# Altium project DIgiBRD.PrjPcb
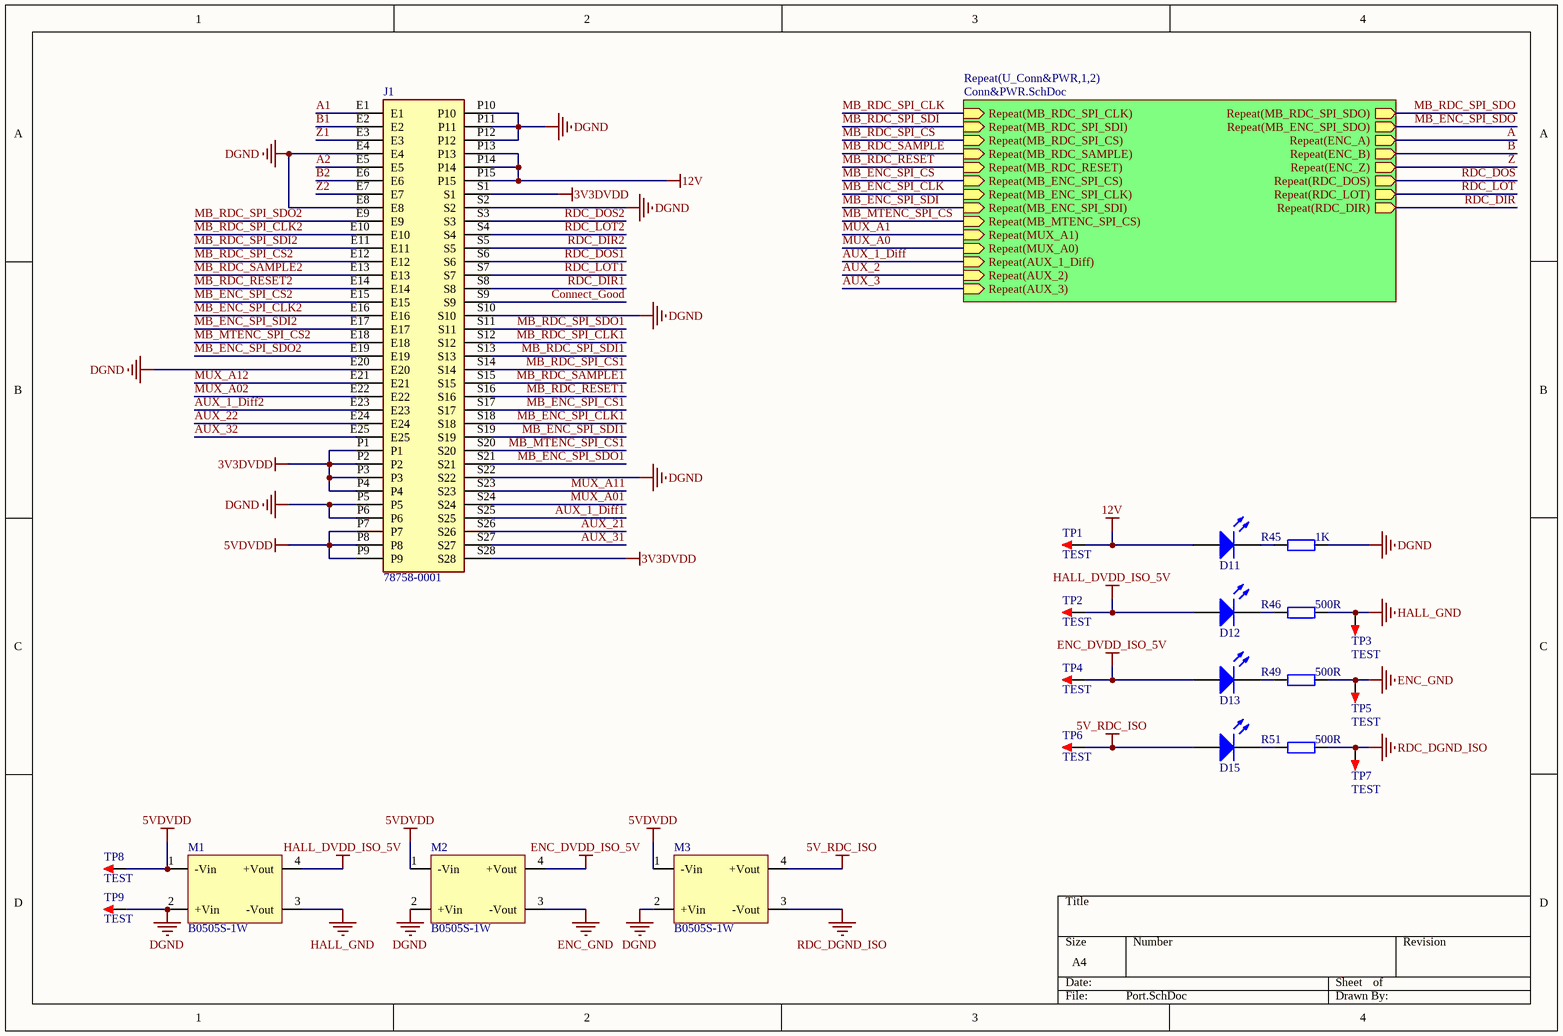
[diagram p0: Port.SchDoc]
4 sheets, 275 parts. Net scope: hierarchical (ports join the sheet entries above them; power ports are global).
Board file: DIGIBRD.PcbDoc
Sheets:
  Port.SchDoc
    U_Conn&PWR1 = Conn&PWR.SchDoc
      U_DiffEncoder = DiffEncoder.SchDoc
      U_Resolver = Resolver.SchDoc
    U_Conn&PWR2 = Conn&PWR.SchDoc
      U_DiffEncoder = DiffEncoder.SchDoc
      U_Resolver = Resolver.SchDoc

## Sheet Port.SchDoc
size A4; SheetNumber: 1; SheetTotal: 4

### Parts
D11  LED  [LED 0603W]  (value not drawn)
D12  LED  [LED 0603W]  (value not drawn)
D13  LED  [LED 0603W]  (value not drawn)
D15  LED  [LED 0603W]  (value not drawn)
J1  78758-0001  [78758-0001]
M1  B0505S-1W  [B0505S-1W]
M2  B0505S-1W  [B0505S-1W]
M3  B0505S-1W  [B0505S-1W]
R45  1K  [R 0603_L]
R46  500R  [R 0603_L]
R49  500R  [R 0603_L]
R51  500R  [R 0603_L]
TP1  TEST  [TEST 1.6]
TP2  TEST  [TEST 1.6]
TP3  TEST  [TEST 1.6]
TP4  TEST  [TEST 1.6]
TP5  TEST  [TEST 1.6]
TP6  TEST  [TEST 1.6]
TP7  TEST  [TEST 1.6]
TP8  TEST  [TEST 1.6]
TP9  TEST  [TEST 1.6]

### Sub-sheets
Repeat(U_Conn&PWR,1,2) = Conn&PWR.SchDoc: Repeat(MB_RDC_SPI_CLK) (in), Repeat(MB_RDC_SPI_SDI) (in), Repeat(MB_RDC_SPI_CS) (in), Repeat(MB_RDC_SAMPLE) (in), Repeat(MB_RDC_SPI_SDO) (out), Repeat(MB_RDC_RESET) (in), Repeat(MB_ENC_SPI_SDO) (out), Repeat(MB_ENC_SPI_CS) (in), Repeat(MB_ENC_SPI_CLK) (in), Repeat(MB_ENC_SPI_SDI) (in), Repeat(MB_MTENC_SPI_CS) (in), Repeat(ENC_A) (out), Repeat(ENC_B) (out), Repeat(ENC_Z) (out), Repeat(MUX_A1) (in), Repeat(MUX_A0) (in), Repeat(RDC_DOS) (out), Repeat(RDC_LOT) (out), Repeat(RDC_DIR) (out), Repeat(AUX_1_Diff) (in), Repeat(AUX_2) (in), Repeat(AUX_3) (in)

### Nets
3V3DVDD: J1.P1 J1.P2 J1.P3 J1.P4 J1.S1 J1.S28
5V_RDC_ISO: D15.1(A) M3.4(+Vout) TP6.1
5VDVDD: J1.P7 J1.P8 J1.P9 M1.1(-Vin) M2.1(-Vin) M3.1(-Vin) TP8.1
12V: D11.1(A) J1.P13 J1.P14 J1.P15 TP1.1
DGND: J1.E4 J1.E8 J1.E20 J1.P5 J1.P6 J1.P10 J1.P11 J1.P12 J1.S2 J1.S10 J1.S22 M1.2(+Vin) M2.2(+Vin) M3.2(+Vin) R45.1 TP9.1
ENC_DVDD_ISO_5V: D13.1(A) M2.4(+Vout) TP4.1
ENC_GND: M2.3(-Vout) R49.1 TP5.1
HALL_DVDD_ISO_5V: D12.1(A) M1.4(+Vout) TP2.1
HALL_GND: M1.3(-Vout) R46.1 TP3.1
RDC_DGND_ISO: M3.3(-Vout) R51.1 TP7.1
A: sheet Repeat(U_Conn&PWR,1,2)/Repeat(ENC_A)
A1: J1.E1
A2: J1.E5
AUX_1_Diff: sheet Repeat(U_Conn&PWR,1,2)/Repeat(AUX_1_Diff)
AUX_1_Diff1: J1.S25
AUX_1_Diff2: J1.E23
AUX_2: sheet Repeat(U_Conn&PWR,1,2)/Repeat(AUX_2)
AUX_3: sheet Repeat(U_Conn&PWR,1,2)/Repeat(AUX_3)
AUX_21: J1.S26
AUX_22: J1.E24
AUX_31: J1.S27
AUX_32: J1.E25
B: sheet Repeat(U_Conn&PWR,1,2)/Repeat(ENC_B)
B1: J1.E2
B2: J1.E6
Connect_Good: J1.S9
MB_ENC_SPI_CLK: sheet Repeat(U_Conn&PWR,1,2)/Repeat(MB_ENC_SPI_CLK)
MB_ENC_SPI_CLK1: J1.S18
MB_ENC_SPI_CLK2: J1.E16
MB_ENC_SPI_CS: sheet Repeat(U_Conn&PWR,1,2)/Repeat(MB_ENC_SPI_CS)
MB_ENC_SPI_CS1: J1.S17
MB_ENC_SPI_CS2: J1.E15
MB_ENC_SPI_SDI: sheet Repeat(U_Conn&PWR,1,2)/Repeat(MB_ENC_SPI_SDI)
MB_ENC_SPI_SDI1: J1.S19
MB_ENC_SPI_SDI2: J1.E17
MB_ENC_SPI_SDO: sheet Repeat(U_Conn&PWR,1,2)/Repeat(MB_ENC_SPI_SDO)
MB_ENC_SPI_SDO1: J1.S21
MB_ENC_SPI_SDO2: J1.E19
MB_MTENC_SPI_CS: sheet Repeat(U_Conn&PWR,1,2)/Repeat(MB_MTENC_SPI_CS)
MB_MTENC_SPI_CS1: J1.S20
MB_MTENC_SPI_CS2: J1.E18
MB_RDC_RESET: sheet Repeat(U_Conn&PWR,1,2)/Repeat(MB_RDC_RESET)
MB_RDC_RESET1: J1.S16
MB_RDC_RESET2: J1.E14
MB_RDC_SAMPLE: sheet Repeat(U_Conn&PWR,1,2)/Repeat(MB_RDC_SAMPLE)
MB_RDC_SAMPLE1: J1.S15
MB_RDC_SAMPLE2: J1.E13
MB_RDC_SPI_CLK: sheet Repeat(U_Conn&PWR,1,2)/Repeat(MB_RDC_SPI_CLK)
MB_RDC_SPI_CLK1: J1.S12
MB_RDC_SPI_CLK2: J1.E10
MB_RDC_SPI_CS: sheet Repeat(U_Conn&PWR,1,2)/Repeat(MB_RDC_SPI_CS)
MB_RDC_SPI_CS1: J1.S14
MB_RDC_SPI_CS2: J1.E12
MB_RDC_SPI_SDI: sheet Repeat(U_Conn&PWR,1,2)/Repeat(MB_RDC_SPI_SDI)
MB_RDC_SPI_SDI1: J1.S13
MB_RDC_SPI_SDI2: J1.E11
MB_RDC_SPI_SDO: sheet Repeat(U_Conn&PWR,1,2)/Repeat(MB_RDC_SPI_SDO)
MB_RDC_SPI_SDO1: J1.S11
MB_RDC_SPI_SDO2: J1.E9
MUX_A0: sheet Repeat(U_Conn&PWR,1,2)/Repeat(MUX_A0)
MUX_A01: J1.S24  [project net MUX_A0]
MUX_A1: sheet Repeat(U_Conn&PWR,1,2)/Repeat(MUX_A1)
MUX_A02: J1.E22  [project net MUX_A0]
MUX_A11: J1.S23  [project net MUX_A1]
MUX_A12: J1.E21  [project net MUX_A1]
RDC_DIR: sheet Repeat(U_Conn&PWR,1,2)/Repeat(RDC_DIR)
RDC_DIR1: J1.S8
RDC_DIR2: J1.S5
RDC_DOS: sheet Repeat(U_Conn&PWR,1,2)/Repeat(RDC_DOS)
RDC_DOS1: J1.S6
RDC_DOS2: J1.S3
RDC_LOT: sheet Repeat(U_Conn&PWR,1,2)/Repeat(RDC_LOT)
RDC_LOT1: J1.S7
RDC_LOT2: J1.S4
Z: sheet Repeat(U_Conn&PWR,1,2)/Repeat(ENC_Z)
Z1: J1.E3  [project net ENC_Z]
Z2: J1.E7  [project net ENC_Z]
NetD11_2: D11.2(K) R45.2
NetD12_2: D12.2(K) R46.2
NetD13_2: D13.2(K) R49.2
NetD15_2: D15.2(K) R51.2

### Library data of the parts
D11-D13 D15 = LED: 发光二极管; 技术支持，联系售后: https://shop463601444.taobao.com
J1 = 78758-0001: Connector; Manufacturer_Name: Molex; Manufacturer_Part_Number: 78758-0001; Mouser Part Number: 538-78758-0001; Mouser Price/Stock: https://www.mouser.co.uk/ProductDetail/Molex/78758-0001?qs=wOSGPAwRNAFEK7d2ROR5rw%3D%3D
M1-M3 = B0505S-1W: DC-DC模块; 版权归属: 封装库来自淘宝 ID：黄晶宝石; BOM名称: DC-DC模块; 学习资源: https://shop463601444.taobao.com
R45 R46 R49 R51 = R: 贴片电阻; 版权归属: 来自淘宝 ID：黄晶宝石; 封装库来自淘宝卖家 ID：黄晶宝石: 其他店铺购入均为盗版，不享受售后技术支持服务，请立即申请退款; BOM名称: 贴片电阻; 联系售后: https://shop463601444.taobao.com
TP1-TP9 = TEST: 测试点; 版权归属: 封装库来自淘宝 ID：黄晶宝石; BOM名称: 测试点; 学习资源: https://shop463601444.taobao.com

## Sheet Conn&PWR.SchDoc
size A4; SheetNumber: 2; SheetTotal: 4
Used 2 times, as channels U_Conn&PWR1, U_Conn&PWR2. Parts and nets are listed once, with the designators drawn on the sheet.
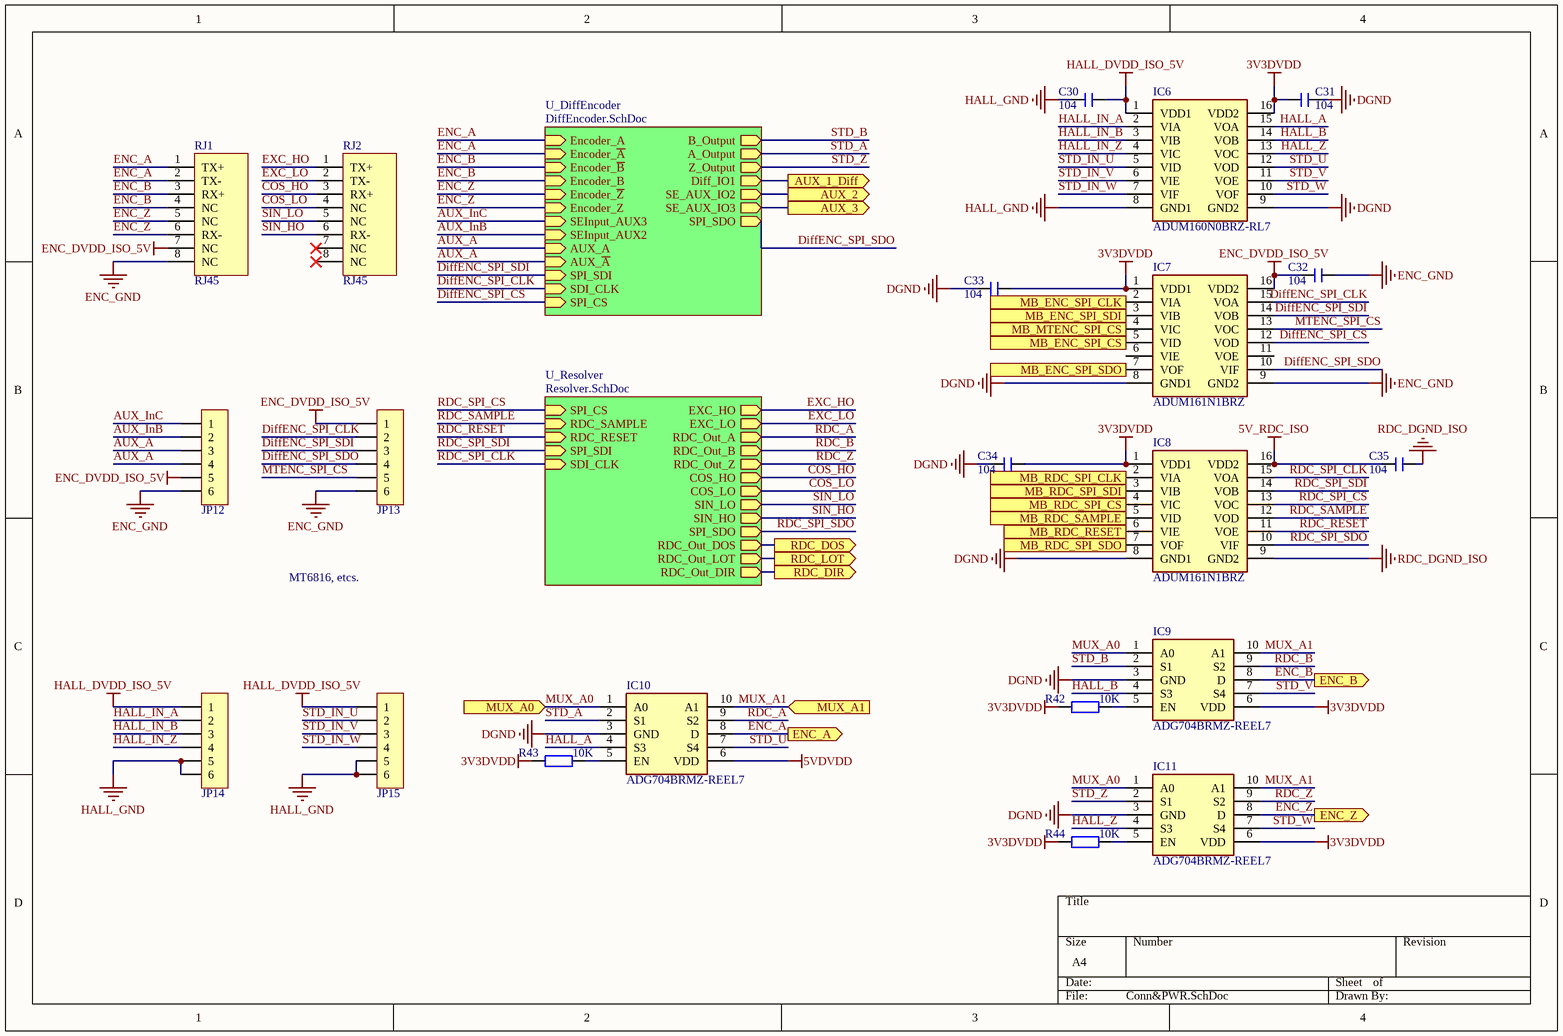
[diagram p1: Conn&PWR.SchDoc]

### Parts
C30  104  [C 0603_L]
C31  104  [C 0603_L]
C32  104  [C 0603_L]
C33  104  [C 0603_L]
C34  104  [C 0603_L]
C35  104  [C 0603_L]
IC6  ADUM160N0BRZ-RL7  [SOIC127P600X175-16N]
IC7  ADUM161N1BRZ  [SOIC127P600X175-16N]
IC8  ADUM161N1BRZ  [SOIC127P600X175-16N]
IC9  ADG704BRMZ-REEL7  [SOP50P490X110-10N]
IC10  ADG704BRMZ-REEL7  [SOP50P490X110-10N]
IC11  ADG704BRMZ-REEL7  [SOP50P490X110-10N]
JP12  HDR-1X6  [KF2EDGK5.08-LI-6P]  (value not drawn)
JP13  HDR-1X6  [KF2EDGK5.08-LI-6P]  (value not drawn)
JP14  HDR-1X6  [KF2EDGK5.08-LI-6P]  (value not drawn)
JP15  HDR-1X6  [KF2EDGK5.08-LI-6P]  (value not drawn)
R42  10K  [R 0603_L]
R43  10K  [R 0603_L]
R44  10K  [R 0603_L]
RJ1  RJ45  [RJ45-2]
RJ2  RJ45  [RJ45-2]

### Sub-sheets
U_DiffEncoder = DiffEncoder.SchDoc: Encoder_A (in), Encoder_~{A} (in), Encoder_~{B} (in), Encoder_B (in), Encoder_~{Z} (in), Encoder_Z (in), B_Output (out), A_Output (out), Z_Output (out), SEInput_AUX3 (in), Diff_IO1 (out), SEInput_AUX2 (in), AUX_A (in), AUX_~{A} (in), SE_AUX_IO2 (out), SE_AUX_IO3 (out), SPI_SDI (in), SDI_CLK (in), SPI_CS (in), SPI_SDO (out)
U_Resolver = Resolver.SchDoc: EXC_HO (out), EXC_LO (out), RDC_Out_A (out), RDC_Out_B (out), RDC_Out_Z (out), COS_HO (out), COS_LO (out), SIN_LO (out), SIN_HO (out), SPI_CS (in), RDC_SAMPLE (in), RDC_RESET (in), SPI_SDI (in), SPI_SDO (out), SDI_CLK (in), RDC_Out_DOS (out), RDC_Out_LOT (out), RDC_Out_DIR (out)

### Ports
AUX_1_Diff (out), AUX_2 (out), AUX_3 (out), ENC_A (out), ENC_B (out), ENC_Z (out), MB_ENC_SPI_CLK (in), MB_ENC_SPI_CS (in), MB_ENC_SPI_SDI (in), MB_ENC_SPI_SDO (out), MB_MTENC_SPI_CS (in), MB_RDC_RESET (in), MB_RDC_SAMPLE (in), MB_RDC_SPI_CLK (in), MB_RDC_SPI_CS (in), MB_RDC_SPI_SDI (in), MB_RDC_SPI_SDO (out), MUX_A0 (in), MUX_A1 (in), RDC_DIR (out), RDC_DOS (out), RDC_LOT (out)

### Nets
3V3DVDD: C31.2 C33.1 C34.1 IC6.16(VDD2) IC7.1(VDD1) IC8.1(VDD1) IC9.6(VDD) IC11.6(VDD) R42.2 R43.2 R44.2
5V_RDC_ISO: C35.2 IC8.16(VDD2)
5VDVDD: IC10.6(VDD)
DGND: C31.1 C33.2 C34.2 IC6.9(GND2) IC7.8(GND1) IC8.8(GND1) IC9.3(GND) IC10.3(GND) IC11.3(GND)
ENC_DVDD_ISO_5V: C32.2 IC7.16(VDD2) JP12.5 JP13.1 RJ1.7(NC)
ENC_GND: C32.1 IC7.9(GND2) JP12.6 JP13.6 RJ1.8(NC)
HALL_DVDD_ISO_5V: C30.1 IC6.1(VDD1) JP14.1 JP15.1
HALL_GND: C30.2 IC6.8(GND1) JP14.5 JP14.6 JP15.5 JP15.6
RDC_DGND_ISO: C35.1 IC8.9(GND2)
AUX_1_Diff: port AUX_1_Diff, sheet U_DiffEncoder/Diff_IO1
AUX_2: port AUX_2, sheet U_DiffEncoder/SE_AUX_IO2
AUX_3: port AUX_3, sheet U_DiffEncoder/SE_AUX_IO3
AUX_A: JP12.3 ; sheet U_DiffEncoder/AUX_A
AUX_~{A}: JP12.4 ; sheet U_DiffEncoder/AUX_~{A}
AUX_InB: JP12.2 ; sheet U_DiffEncoder/SEInput_AUX2
AUX_InC: JP12.1 ; sheet U_DiffEncoder/SEInput_AUX3
COS_HO: RJ2.3(RX+) ; sheet U_Resolver/COS_HO
COS_LO: RJ2.4(NC) ; sheet U_Resolver/COS_LO
DiffENC_SPI_CLK: IC7.15(VOA) JP13.2 ; sheet U_DiffEncoder/SDI_CLK
DiffENC_SPI_CS: IC7.12(VOD) ; sheet U_DiffEncoder/SPI_CS
DiffENC_SPI_SDI: IC7.14(VOB) JP13.3 ; sheet U_DiffEncoder/SPI_SDI
DiffENC_SPI_SDO: IC7.10(VIF) JP13.4 ; sheet U_DiffEncoder/SPI_SDO
ENC_A: IC10.8(D) RJ1.1(TX+) ; port ENC_A, sheet U_DiffEncoder/Encoder_A
ENC_~{A}: RJ1.2(TX-) ; sheet U_DiffEncoder/Encoder_~{A}
ENC_B: IC9.8(D) RJ1.3(RX+) ; port ENC_B, sheet U_DiffEncoder/Encoder_B
ENC_~{B}: RJ1.4(NC) ; sheet U_DiffEncoder/Encoder_~{B}
ENC_Z: IC11.8(D) RJ1.5(NC) ; port ENC_Z, sheet U_DiffEncoder/Encoder_Z
ENC_~{Z}: RJ1.6(RX-) ; sheet U_DiffEncoder/Encoder_~{Z}
EXC_HO: RJ2.1(TX+) ; sheet U_Resolver/EXC_HO
EXC_LO: RJ2.2(TX-) ; sheet U_Resolver/EXC_LO
HALL_A: IC6.15(VOA) IC10.4(S3)
HALL_B: IC6.14(VOB) IC9.4(S3)
HALL_IN_A: IC6.2(VIA) JP14.2
HALL_IN_B: IC6.3(VIB) JP14.3
HALL_IN_Z: IC6.4(VIC) JP14.4
HALL_Z: IC6.13(VOC) IC11.4(S3)
MB_ENC_SPI_CLK: IC7.2(VIA) ; port MB_ENC_SPI_CLK
MB_ENC_SPI_CS: IC7.5(VID) ; port MB_ENC_SPI_CS
MB_ENC_SPI_SDI: IC7.3(VIB) ; port MB_ENC_SPI_SDI
MB_ENC_SPI_SDO: IC7.7(VOF) ; port MB_ENC_SPI_SDO
MB_MTENC_SPI_CS: IC7.4(VIC) ; port MB_MTENC_SPI_CS
MB_RDC_RESET: IC8.6(VIE) ; port MB_RDC_RESET
MB_RDC_SAMPLE: IC8.5(VID) ; port MB_RDC_SAMPLE
MB_RDC_SPI_CLK: IC8.2(VIA) ; port MB_RDC_SPI_CLK
MB_RDC_SPI_CS: IC8.4(VIC) ; port MB_RDC_SPI_CS
MB_RDC_SPI_SDI: IC8.3(VIB) ; port MB_RDC_SPI_SDI
MB_RDC_SPI_SDO: IC8.7(VOF) ; port MB_RDC_SPI_SDO
MTENC_SPI_CS: IC7.13(VOC) JP13.5
MUX_A0: IC9.1(A0) IC10.1(A0) IC11.1(A0) ; port MUX_A0
MUX_A1: IC9.10(A1) IC10.10(A1) IC11.10(A1) ; port MUX_A1
RDC_A: IC10.9(S2) ; sheet U_Resolver/RDC_Out_A
RDC_B: IC9.9(S2) ; sheet U_Resolver/RDC_Out_B
RDC_DIR: port RDC_DIR, sheet U_Resolver/RDC_Out_DIR
RDC_DOS: port RDC_DOS, sheet U_Resolver/RDC_Out_DOS
RDC_LOT: port RDC_LOT, sheet U_Resolver/RDC_Out_LOT
RDC_RESET: IC8.11(VOE) ; sheet U_Resolver/RDC_RESET
RDC_SAMPLE: IC8.12(VOD) ; sheet U_Resolver/RDC_SAMPLE
RDC_SPI_CLK: IC8.15(VOA) ; sheet U_Resolver/SDI_CLK
RDC_SPI_CS: IC8.13(VOC) ; sheet U_Resolver/SPI_CS
RDC_SPI_SDI: IC8.14(VOB) ; sheet U_Resolver/SPI_SDI
RDC_SPI_SDO: IC8.10(VIF) ; sheet U_Resolver/SPI_SDO
RDC_Z: IC11.9(S2) ; sheet U_Resolver/RDC_Out_Z
SIN_HO: RJ2.6(RX-) ; sheet U_Resolver/SIN_HO
SIN_LO: RJ2.5(NC) ; sheet U_Resolver/SIN_LO
STD_A: IC10.2(S1) ; sheet U_DiffEncoder/A_Output
STD_B: IC9.2(S1) ; sheet U_DiffEncoder/B_Output
STD_IN_U: IC6.5(VID) JP15.2
STD_IN_V: IC6.6(VIE) JP15.3
STD_IN_W: IC6.7(VIF) JP15.4
STD_U: IC6.12(VOD) IC10.7(S4)
STD_V: IC6.11(VOE) IC9.7(S4)
STD_W: IC6.10(VOF) IC11.7(S4)
STD_Z: IC11.2(S1) ; sheet U_DiffEncoder/Z_Output
NetIC9_5: IC9.5(EN) R42.1
NetIC10_5: IC10.5(EN) R43.1
NetIC11_5: IC11.5(EN) R44.1

Not connected (* = marked no-connect by the designer): IC7 6(VIE) 11(VOE); RJ2 7(NC)* 8(NC)*

### Channels
U_Conn&PWR1: designators end in A; ports AUX_1_Diff=AUX_1_Diff1 AUX_2=AUX_21 AUX_3=AUX_31 ENC_A=A1 ENC_B=B1 ENC_Z=ENC_Z MB_ENC_SPI_CLK=MB_ENC_SPI_CLK1 MB_ENC_SPI_CS=MB_ENC_SPI_CS1 MB_ENC_SPI_SDI=MB_ENC_SPI_SDI1 MB_ENC_SPI_SDO=MB_ENC_SPI_SDO1 MB_MTENC_SPI_CS=MB_MTENC_SPI_CS1 MB_RDC_RESET=MB_RDC_RESET1 MB_RDC_SAMPLE=MB_RDC_SAMPLE1 MB_RDC_SPI_CLK=MB_RDC_SPI_CLK1 MB_RDC_SPI_CS=MB_RDC_SPI_CS1 MB_RDC_SPI_SDI=MB_RDC_SPI_SDI1 MB_RDC_SPI_SDO=MB_RDC_SPI_SDO1 MUX_A0=MUX_A0 MUX_A1=MUX_A1 RDC_DIR=RDC_DIR1 RDC_DOS=RDC_DOS1 RDC_LOT=RDC_LOT1
U_Conn&PWR2: designators end in B; ports AUX_1_Diff=AUX_1_Diff2 AUX_2=AUX_22 AUX_3=AUX_32 ENC_A=A2 ENC_B=B2 ENC_Z=ENC_Z MB_ENC_SPI_CLK=MB_ENC_SPI_CLK2 MB_ENC_SPI_CS=MB_ENC_SPI_CS2 MB_ENC_SPI_SDI=MB_ENC_SPI_SDI2 MB_ENC_SPI_SDO=MB_ENC_SPI_SDO2 MB_MTENC_SPI_CS=MB_MTENC_SPI_CS2 MB_RDC_RESET=MB_RDC_RESET2 MB_RDC_SAMPLE=MB_RDC_SAMPLE2 MB_RDC_SPI_CLK=MB_RDC_SPI_CLK2 MB_RDC_SPI_CS=MB_RDC_SPI_CS2 MB_RDC_SPI_SDI=MB_RDC_SPI_SDI2 MB_RDC_SPI_SDO=MB_RDC_SPI_SDO2 MUX_A0=MUX_A0 MUX_A1=MUX_A1 RDC_DIR=RDC_DIR2 RDC_DOS=RDC_DOS2 RDC_LOT=RDC_LOT2

### Notes on the sheet
- MT6816, etcs.

### Library data of the parts
C30-C35 = C: 贴片电容; BOM名称: 无极性贴片电容; 淘宝ID: 封装库来自淘宝 ID：黄晶宝石; 联系售后，技术支持: https://shop463601444.taobao.com; 唯一出售店铺网址: https://shop463601444.taobao.com
IC6 = ADUM160N0BRZ-RL7: Integrated Circuit; Manufacturer_Name: Analog Devices; Datasheet Link: https://www.analog.com/media/en/technical-documentation/data-sheets/adum160n-161n-162n-163n.pdf; Height: 1.75mm; Manufacturer_Part_Number: ADUM160N0BRZ-RL7; Mouser Part Number: 584-ADUM160N0BRZ-RL7; Mouser Price/Stock: https://www.mouser.co.uk/ProductDetail/Analog-Devices/ADUM160N0BRZ-RL7?qs=cslStgdnz9OW1mXsMBZKfA%3D%3D; Arrow Part Number: ADUM160N0BRZ-RL7; Arrow Price/Stock: https://www.arrow.com/en/products/adum160n0brz-rl7/analog-devices
IC7 IC8 = ADUM161N1BRZ: Integrated Circuit; Manufacturer_Name: Analog Devices; Datasheet Link: https://componentsearchengine.com/Datasheets/1/ADUM161N1BRZ.pdf; Height: 1.75mm; Manufacturer_Part_Number: ADUM161N1BRZ; Mouser Part Number: 584-ADUM161N1BRZ; Mouser Price/Stock: https://www.mouser.co.uk/ProductDetail/Analog-Devices/ADUM161N1BRZ?qs=cslStgdnz9PXnDzAofgUAA%3D%3D; Arrow Part Number: ADUM161N1BRZ; Arrow Price/Stock: https://www.arrow.com/en/products/adum161n1brz/analog-devices
IC9-IC11 = ADG704BRMZ-REEL7: Integrated Circuit; Manufacturer_Name: Analog Devices; Datasheet Link: http://componentsearchengine.com/Datasheets/1/ADG704BRMZ-REEL7.pdf; Manufacturer_Part_Number: ADG704BRMZ-REEL7; Mouser Part Number: 584-ADG704BRMZ-R7; Mouser Price/Stock: https://www.mouser.co.uk/ProductDetail/Analog-Devices/ADG704BRMZ-REEL7?qs=BpaRKvA4VqF8DSGt0vw8%252Bg%3D%3D; Arrow Part Number: ADG704BRMZ-REEL7; Arrow Price/Stock: https://www.arrow.com/en/products/adg704brmz-reel7/analog-devices?region=nac
JP12-JP15 = Header 6: 6P接插件; 版权归属: 封装库来自淘宝卖家 ID：黄晶宝石; BOM名称: 6P接插件; 学习资源: https://shop463601444.taobao.com
R42-R44 = R: as R45 on sheet Port; BOM名称: 贴片电阻; 联系售后: https://shop463601444.taobao.com
RJ1 RJ2 = RJ45: 以太网接口; BOM名称: 以太网接口

## Sheet DiffEncoder.SchDoc
size A4; SheetNumber: 3; SheetTotal: 4
Used 2 times, as channels U_Conn&PWR1/U_DiffEncoder, U_Conn&PWR2/U_DiffEncoder. Parts and nets are listed once, with the designators drawn on the sheet.
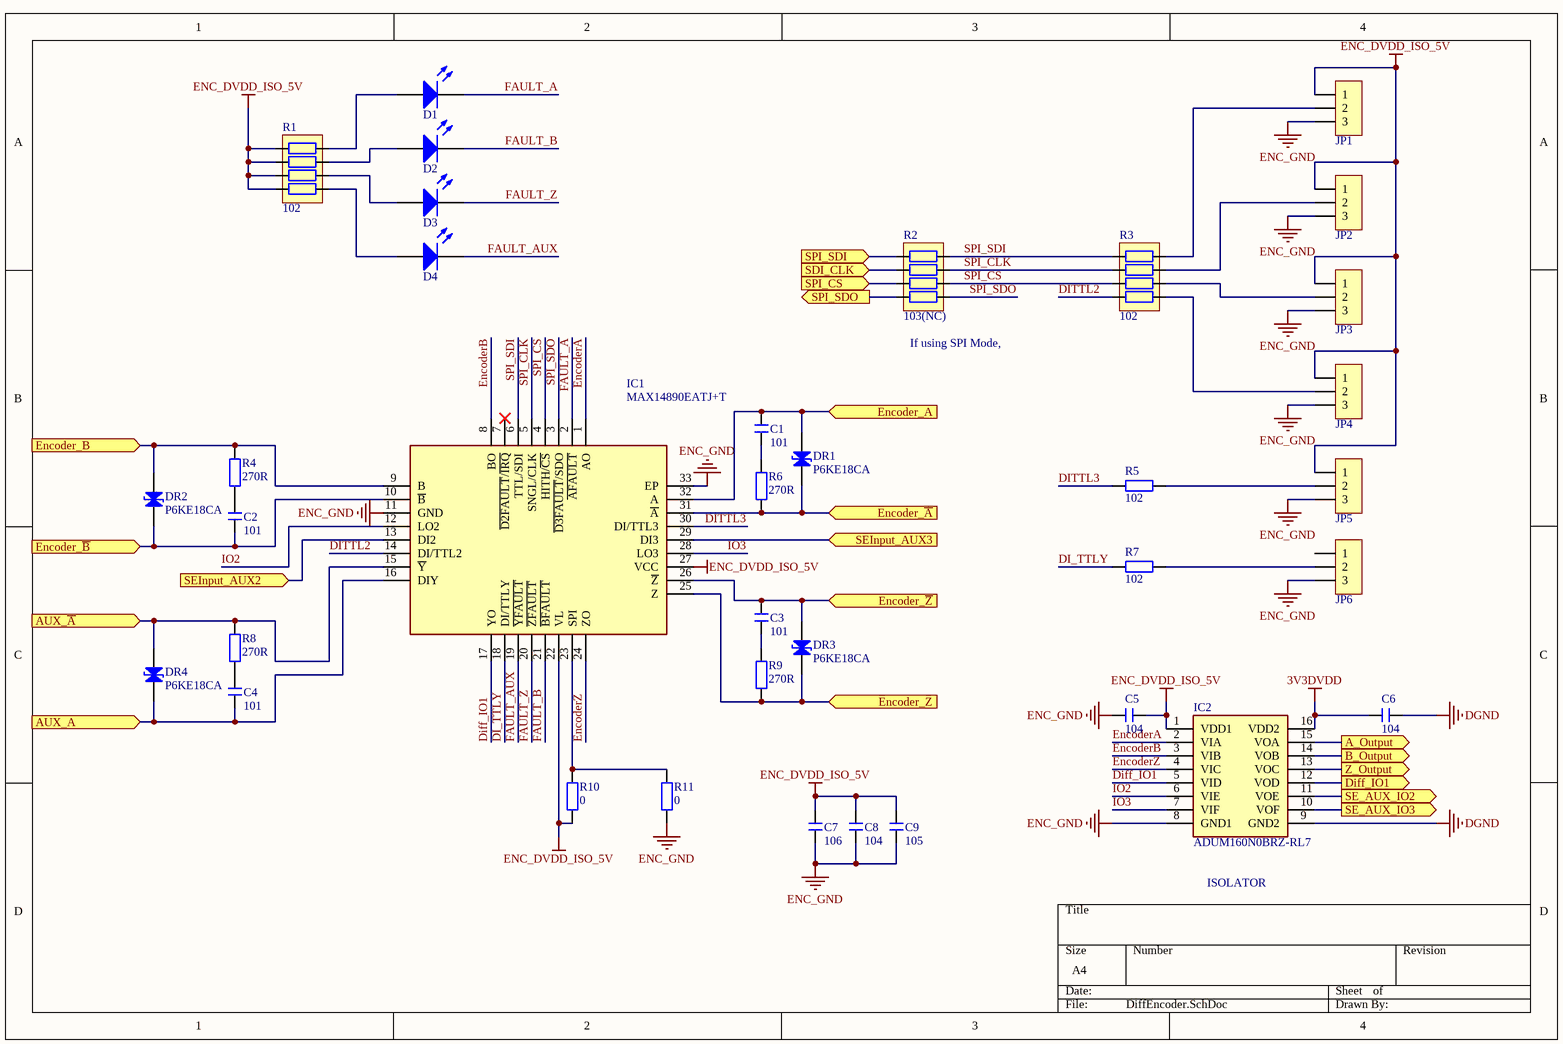
[diagram p2: DiffEncoder.SchDoc]

### Parts
C1  101  [C 0603_L]
C2  101  [C 0603_L]
C3  101  [C 0603_L]
C4  101  [C 0603_L]
C5  104  [C 0603_L]
C6  104  [C 0603_L]
C7  106  [C 0603_L]
C8  104  [C 0603_L]
C9  105  [C 0603_L]
D1  LED  [LED 0603W]  (value not drawn)
D2  LED  [LED 0603W]  (value not drawn)
D3  LED  [LED 0603W]  (value not drawn)
D4  LED  [LED 0603W]  (value not drawn)
DR1  P6KE18CA  [SMA]
DR2  P6KE18CA  [SMA]
DR3  P6KE18CA  [SMA]
DR4  P6KE18CA  [SMA]
IC1  MAX14890EATJ+T  [QFN50P500X500X80-33N]
IC2  ADUM160N0BRZ-RL7  [SOIC127P600X175-16N]
JP1  HDR-1X3  [HDR2.54-LI-3P]  (value not drawn)
JP2  HDR-1X3  [HDR2.54-LI-3P]  (value not drawn)
JP3  HDR-1X3  [HDR2.54-LI-3P]  (value not drawn)
JP4  HDR-1X3  [HDR2.54-LI-3P]  (value not drawn)
JP5  HDR-1X3  [HDR2.54-LI-3P]  (value not drawn)
JP6  HDR-1X3  [HDR2.54-LI-3P]  (value not drawn)
R1  102  [RCA-8P4R-0603]
R2  103(NC)  [RCA-8P4R-0603]
R3  102  [RCA-8P4R-0603]
R4  270R  [R 0603_L]
R5  102  [R 0603_L]
R6  270R  [R 0603_L]
R7  102  [R 0603_L]
R8  270R  [R 0603_L]
R9  270R  [R 0603_L]
R10  0  [R 0603_L]
R11  0  [R 0603_L]

### Ports
A_Output (out), AUX_A (in), AUX_~{A} (in), B_Output (out), Diff_IO1 (out), Encoder_A (in), Encoder_B (in), Encoder_Z (in), Encoder_~{A} (in), Encoder_~{B} (in), Encoder_~{Z} (in), SDI_CLK (in), SE_AUX_IO2 (out), SE_AUX_IO3 (out), SEInput_AUX2 (in), SEInput_AUX3 (in), SPI_CS (in), SPI_SDI (in), SPI_SDO (out), Z_Output (out)

### Nets
3V3DVDD: C6.2 IC2.16(VDD2)
DGND: C6.1 IC2.9(GND2)
ENC_DVDD_ISO_5V: C5.1 C7.2 C8.2 C9.2 IC1.22(VL) IC1.27(VCC) IC2.1(VDD1) JP1.1 JP2.1 JP3.1 JP4.1 JP5.1 R1.1 R1.2 R1.3 R1.4 R10.1
ENC_GND: C5.2 C7.1 C8.1 C9.1 IC1.11(GND) IC1.33(EP) IC2.8(GND1) JP1.3 JP2.3 JP3.3 JP4.3 JP5.3 JP6.3 R11.2
A_Output: IC2.15(VOA) ; port A_Output
AUX_A: C4.1 DR4.2(K) IC1.16(DIY) ; port AUX_A
AUX_~{A}: DR4.1(A) IC1.15(~{Y}) R8.2 ; port AUX_~{A}
B_Output: IC2.14(VOB) ; port B_Output
DI_TTLY: IC1.18(DI/TTLY) R7.1
Diff_IO1: IC1.17(YO) IC2.5(VID)
Diff_IO1: IC2.12(VOD) ; port Diff_IO1  [a separate net that carries the same name]
DITTL2: IC1.14(DI/TTL2) R3.4
DITTL3: IC1.30(DI/TTL3) R5.1
Encoder_A: C1.1 DR1.1(A) IC1.32(A) ; port Encoder_A
Encoder_~{A}: DR1.2(K) IC1.31(~{A}) R6.2 ; port Encoder_~{A}
Encoder_B: DR2.1(A) IC1.9(B) R4.2 ; port Encoder_B
Encoder_~{B}: C2.1 DR2.2(K) IC1.10(~{B}) ; port Encoder_~{B}
Encoder_Z: DR3.2(K) IC1.25(Z) R9.2 ; port Encoder_Z
Encoder_~{Z}: C3.1 DR3.1(A) IC1.26(~{Z}) ; port Encoder_~{Z}
EncoderA: IC1.1(AO) IC2.2(VIA)
EncoderB: IC1.8(BO) IC2.3(VIB)
EncoderZ: IC1.24(ZO) IC2.4(VIC)
FAULT_A: D1.2(K) IC1.2(~{AFAULT})
FAULT_AUX: D4.2(K) IC1.19(~{YFAULT})
FAULT_B: D2.2(K) IC1.21(~{BFAULT})
FAULT_Z: D3.2(K) IC1.20(~{ZFAULT})
IO2: IC1.12(LO2) IC2.6(VIE)
IO3: IC1.28(LO3) IC2.7(VIF)
SDI_CLK: R2.2 ; port SDI_CLK
SE_AUX_IO2: IC2.11(VOE) ; port SE_AUX_IO2
SE_AUX_IO3: IC2.10(VOF) ; port SE_AUX_IO3
SEInput_AUX2: IC1.13(DI2) ; port SEInput_AUX2
SEInput_AUX3: IC1.29(DI3) ; port SEInput_AUX3
SPI_CLK: IC1.5(SNGL/CLK) R2.7 R3.2
SPI_CS: IC1.4(HITH/~{CS}) R2.6 R3.3
SPI_CS: R2.3 ; port SPI_CS  [a separate net that carries the same name]
SPI_SDI: IC1.6(TTL/SDI) R2.8 R3.1
SPI_SDI: R2.1 ; port SPI_SDI  [a separate net that carries the same name]
SPI_SDO: IC1.3(~{D3FAULT}/SDO) R2.5
SPI_SDO: R2.4 ; port SPI_SDO  [a separate net that carries the same name]
Z_Output: IC2.13(VOC) ; port Z_Output
NetC1_2: C1.2 R6.1
NetC2_2: C2.2 R4.1
NetC3_2: C3.2 R9.1
NetC4_2: C4.2 R8.1
NetD1_1: D1.1(A) R1.8
NetD2_1: D2.1(A) R1.7
NetD3_1: D3.1(A) R1.6
NetD4_1: D4.1(A) R1.5
NetIC1_23: IC1.23(SPI) R10.2 R11.1
NetJP1_2: JP1.2 R3.8
NetJP2_2: JP2.2 R3.7
NetJP3_2: JP3.2 R3.6
NetJP4_2: JP4.2 R3.5
NetJP5_2: JP5.2 R5.2
NetJP6_2: JP6.2 R7.2

Not connected (* = marked no-connect by the designer): IC1 7(~{D2FAULT}/~{IRQ})*; JP6 1

### Channels
U_Conn&PWR1/U_DiffEncoder: designators end in A; ports A_Output=STD_A_U_Conn&PWR1 AUX_A=AUX_A_U_Conn&PWR1 AUX_~{A}=AUX_~{A}_U_Conn&PWR1 B_Output=STD_B_U_Conn&PWR1 Diff_IO1=AUX_1_Diff1 Encoder_A=A1 Encoder_B=B1 Encoder_Z=ENC_Z Encoder_~{A}=ENC_~{A}_U_Conn&PWR1 Encoder_~{B}=ENC_~{B}_U_Conn&PWR1 Encoder_~{Z}=ENC_~{Z}_U_Conn&PWR1 SDI_CLK=DiffENC_SPI_CLK_U_Conn&PWR1 SE_AUX_IO2=AUX_21 SE_AUX_IO3=AUX_31 SEInput_AUX2=AUX_InB_U_Conn&PWR1 SEInput_AUX3=AUX_InC_U_Conn&PWR1 SPI_CS=DiffENC_SPI_CS_U_Conn&PWR1 SPI_SDI=DiffENC_SPI_SDI_U_Conn&PWR1 SPI_SDO=DiffENC_SPI_SDO_U_Conn&PWR1 Z_Output=STD_Z_U_Conn&PWR1
U_Conn&PWR2/U_DiffEncoder: designators end in B; ports A_Output=STD_A_U_Conn&PWR2 AUX_A=AUX_A_U_Conn&PWR2 AUX_~{A}=AUX_~{A}_U_Conn&PWR2 B_Output=STD_B_U_Conn&PWR2 Diff_IO1=AUX_1_Diff2 Encoder_A=A2 Encoder_B=B2 Encoder_Z=ENC_Z Encoder_~{A}=ENC_~{A}_U_Conn&PWR2 Encoder_~{B}=ENC_~{B}_U_Conn&PWR2 Encoder_~{Z}=ENC_~{Z}_U_Conn&PWR2 SDI_CLK=DiffENC_SPI_CLK_U_Conn&PWR2 SE_AUX_IO2=AUX_22 SE_AUX_IO3=AUX_32 SEInput_AUX2=AUX_InB_U_Conn&PWR2 SEInput_AUX3=AUX_InC_U_Conn&PWR2 SPI_CS=DiffENC_SPI_CS_U_Conn&PWR2 SPI_SDI=DiffENC_SPI_SDI_U_Conn&PWR2 SPI_SDO=DiffENC_SPI_SDO_U_Conn&PWR2 Z_Output=STD_Z_U_Conn&PWR2

### Notes on the sheet
- (near R2) If using SPI Mode,
- ISOLATOR

### Library data of the parts
C1-C9 = C: as C30 on sheet Conn&PWR; 联系售后，技术支持: https://shop463601444.taobao.com; 唯一出售店铺网址: https://shop463601444.taobao.com
D1-D4 = LED: 发光二极管; 技术支持，联系售后: https://shop463601444.taobao.com
DR1-DR4 = DR: 瞬态电压抑制二极管; 版权归属: 封装库来自淘宝 ID：黄晶宝石; BOM名称: 瞬态电压抑制二极管; 学习资源: https://shop463601444.taobao.com
IC1 = MAX14890EATJ+T: Integrated Circuit; Manufacturer_Name: Analog Devices; Datasheet Link: https://datasheets.maximintegrated.com/en/ds/MAX14890E.pdf; Height: 0.8mm; Manufacturer_Part_Number: MAX14890EATJ+T; Mouser Part Number: 700-MAX14890EATJ+T; Mouser Price/Stock: https://www.mouser.co.uk/ProductDetail/Analog-Devices-Maxim-Integrated/MAX14890EATJ%2bT?qs=OAQKEzuI%2F894x6Nfk0wCQA%3D%3D
IC2 = ADUM160N0BRZ-RL7: as IC6 on sheet Conn&PWR; Datasheet Link: https://www.analog.com/media/en/technical-documentation/data-sheets/adum160n-161n-162n-163n.pdf; Height: 1.75mm; Manufacturer_Part_Number: ADUM160N0BRZ-RL7; Mouser Part Number: 584-ADUM160N0BRZ-RL7; Mouser Price/Stock: https://www.mouser.co.uk/ProductDetail/Analog-Devices/ADUM160N0BRZ-RL7?qs=cslStgdnz9OW1mXsMBZKfA%3D%3D; Arrow Part Number: ADUM160N0BRZ-RL7; Arrow Price/Stock: https://www.arrow.com/en/products/adum160n0brz-rl7/analog-devices
JP1-JP6 = Header 3: 3P接插件; 版权归属: 封装库来自淘宝 ID：黄晶宝石; BOM名称: 3P接插件; 学习资源: https://shop463601444.taobao.com
R1-R3 = R-8P4R: 贴片排阻; BOM名称: 贴片网络排阻; 版权归属: 封装库来自淘宝 ID：黄晶宝石; 联系售后: https://shop463601444.taobao.com
R4-R11 = R: as R45 on sheet Port; BOM名称: 贴片电阻; 联系售后: https://shop463601444.taobao.com

## Sheet Resolver.SchDoc
size A4; SheetNumber: 4; SheetTotal: 4
Used 2 times, as channels U_Conn&PWR1/U_Resolver, U_Conn&PWR2/U_Resolver. Parts and nets are listed once, with the designators drawn on the sheet.
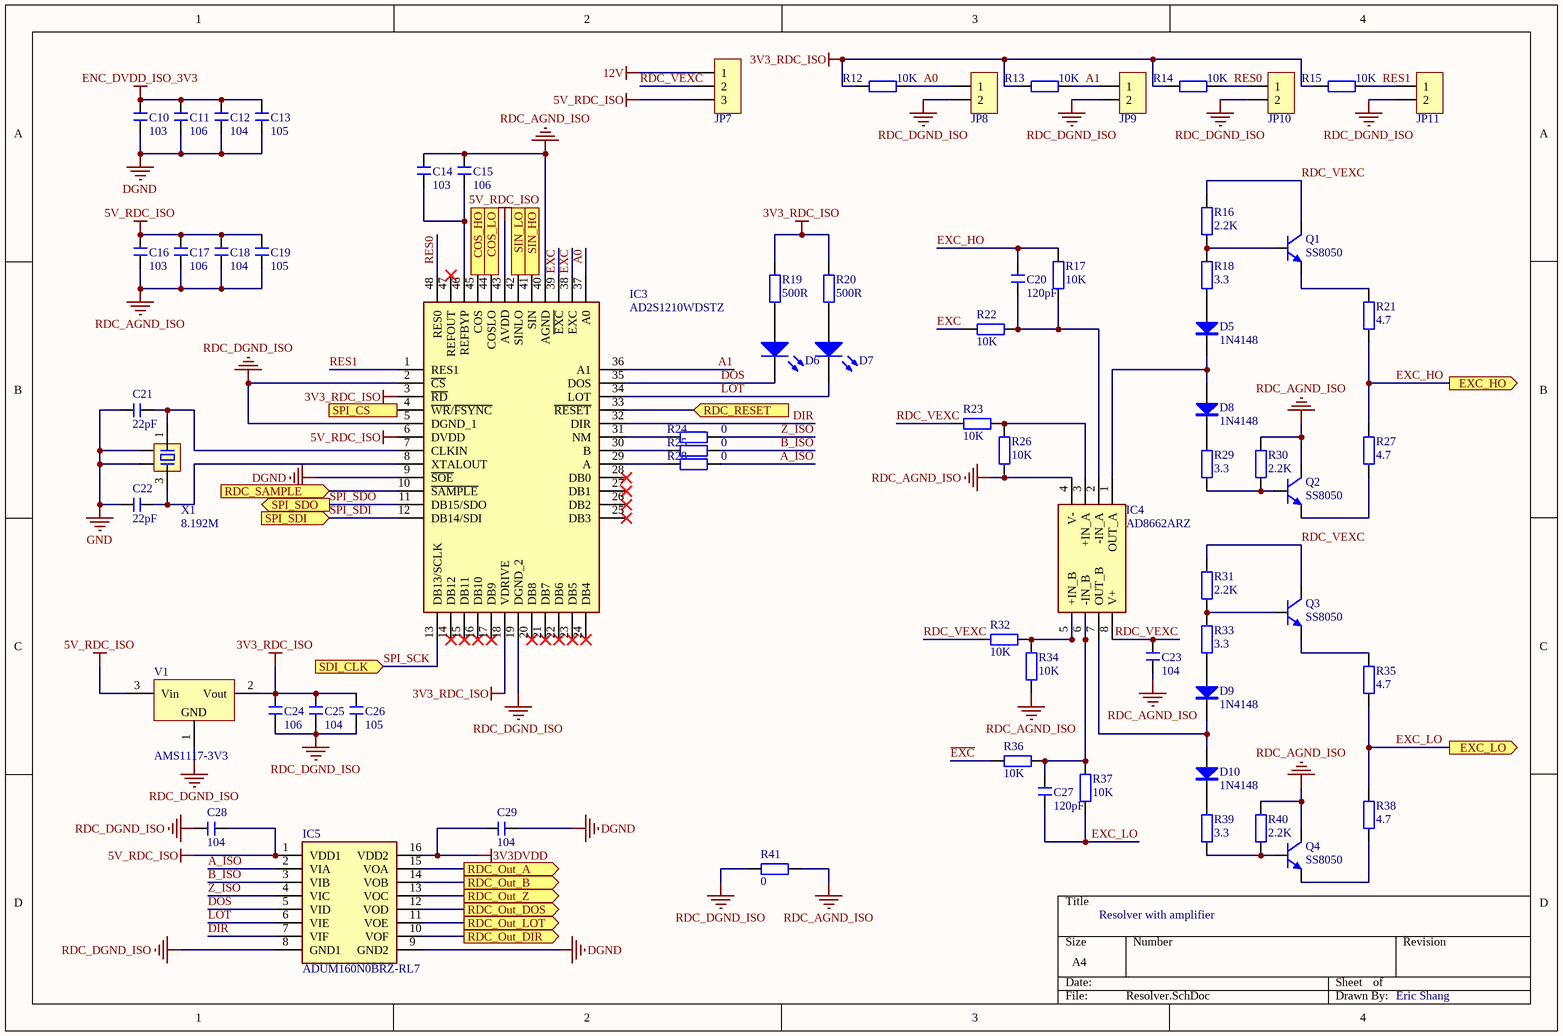
[diagram p3: Resolver.SchDoc]

### Parts
C10  103  [C 0603_L]
C11  106  [C 0603_L]
C12  104  [C 0603_L]
C13  105  [C 0603_L]
C14  103  [C 0603_L]
C15  106  [C 0603_L]
C16  103  [C 0603_L]
C17  106  [C 0603_L]
C18  104  [C 0603_L]
C19  105  [C 0603_L]
C20  120pF  [C 0603_L]
C21  22pF  [C 0603_L]
C22  22pF  [C 0603_L]
C23  104  [C 0603_L]
C24  106  [C 0603_L]
C25  104  [C 0603_L]
C26  105  [C 0603_L]
C27  120pF  [C 0603_L]
C28  104  [C 0603_L]
C29  104  [C 0603_L]
D5  1N4148  [MINI_MELF (LL34)]
D6  LED  [LED 0603W]  (value not drawn)
D7  LED  [LED 0603W]  (value not drawn)
D8  1N4148  [MINI_MELF (LL34)]
D9  1N4148  [MINI_MELF (LL34)]
D10  1N4148  [MINI_MELF (LL34)]
IC3  AD2S1210WDSTZ  [QFP50P900X900X160-48N]
IC4  AD8662ARZ  [SOIC127P600X175-8N]
IC5  ADUM160N0BRZ-RL7  [SOIC127P600X175-16N]
JP7  HDR-1X3  [HDR2.54-LI-3P]  (value not drawn)
JP8  HDR-1X2  [HDR2.54-LI-2P]  (value not drawn)
JP9  HDR-1X2  [HDR2.54-LI-2P]  (value not drawn)
JP10  HDR-1X2  [HDR2.54-LI-2P]  (value not drawn)
JP11  HDR-1X2  [HDR2.54-LI-2P]  (value not drawn)
Q1  SS8050  [SOT23-3N]
Q2  SS8050  [SOT23-3N]
Q3  SS8050  [SOT23-3N]
Q4  SS8050  [SOT23-3N]
R12  10K  [R 0603_L]
R13  10K  [R 0603_L]
R14  10K  [R 0603_L]
R15  10K  [R 0603_L]
R16  2.2K  [R 0603_L]
R17  10K  [R 0603_L]
R18  3.3  [R 0603_L]
R19  500R  [R 0603_L]
R20  500R  [R 0603_L]
R21  4.7  [R 1206_L]
R22  10K  [R 0603_L]
R23  10K  [R 0603_L]
R24  0  [R 0603_L]
R25  0  [R 0603_L]
R26  10K  [R 0603_L]
R27  4.7  [R 1206_L]
R28  0  [R 0603_L]
R29  3.3  [R 0603_L]
R30  2.2K  [R 0603_L]
R31  2.2K  [R 0603_L]
R32  10K  [R 0603_L]
R33  3.3  [R 0603_L]
R34  10K  [R 0603_L]
R35  4.7  [R 1206_L]
R36  10K  [R 0603_L]
R37  10K  [R 0603_L]
R38  4.7  [R 1206_L]
R39  3.3  [R 0603_L]
R40  2.2K  [R 0603_L]
R41  0  [R 1206_L]
V1  AMS1117-3V3  [SOT223_L]
X1  8.192M  [OSC 1612-4P]

### Ports
COS_HO (out), COS_LO (out), EXC_HO (out), EXC_LO (out), RDC_Out_A (out), RDC_Out_B (out), RDC_Out_DIR (out), RDC_Out_DOS (out), RDC_Out_LOT (out), RDC_Out_Z (out), RDC_RESET (in), RDC_SAMPLE (in), SDI_CLK (in), SIN_HO (out), SIN_LO (out), SPI_CS (in), SPI_SDI (in), SPI_SDO (out)

### Nets
3V3_RDC_ISO: C24.2 C25.2 C26.2 IC3.3(~{RD}) IC3.18(VDRIVE) R12.1 R13.1 R14.1 R15.1 R19.2 R20.2 V1.2(Vout)
3V3DVDD: C29.1 IC5.16(VDD2)
5V_RDC_ISO: C16.2 C17.2 C18.2 C19.2 C28.1 IC3.6(DVDD) IC3.43(AVDD) IC5.1(VDD1) JP7.3 V1.3(Vin)
12V: JP7.1
DGND: C10.1 C11.1 C12.1 C13.1 C29.2 IC3.9(~{SOE}) IC5.9(GND2)
ENC_DVDD_ISO_3V3: C10.2 C11.2 C12.2 C13.2
GND: C21.1 C22.1 X1.2 X1.4
RDC_AGND_ISO: C14.2 C15.2 C16.1 C17.1 C18.1 C19.1 C23.1 IC3.40(AGND) IC4.4(V-) Q2.3(C) Q4.3(C) R26.1 R30.2 R34.1 R40.2 R41.1
RDC_DGND_ISO: C24.1 C25.1 C26.1 C28.2 IC3.2(~{CS}) IC3.5(DGND_1) IC3.19(DGND_2) IC5.8(GND1) JP8.2 JP9.2 JP10.2 JP11.2 R41.2 V1.1(GND)
A0: IC3.37(A0) JP8.1 R12.2
A1: IC3.36(A1) JP9.1 R13.2
A_ISO: IC5.2(VIA) R28.2
B_ISO: IC5.3(VIB) R25.2
COS_HO: IC3.45(COS) ; port COS_HO
COS_LO: IC3.44(COSLO) ; port COS_LO
DIR: IC3.32(DIR) IC5.7(VIF)
DOS: D6.2(K) IC3.35(DOS) IC5.5(VID)
~{EXC}: IC3.39(~{EXC}) R36.1
EXC: IC3.38(EXC) R22.1
EXC_HO: C20.2 R17.2 R21.1 R27.2 ; port EXC_HO
EXC_LO: C27.1 R35.1 R37.1 R38.2 ; port EXC_LO
LOT: D7.2(K) IC3.34(LOT) IC5.6(VIE)
RDC_Out_A: IC5.15(VOA) ; port RDC_Out_A
RDC_Out_B: IC5.14(VOB) ; port RDC_Out_B
RDC_Out_DIR: IC5.10(VOF) ; port RDC_Out_DIR
RDC_Out_DOS: IC5.12(VOD) ; port RDC_Out_DOS
RDC_Out_LOT: IC5.11(VOE) ; port RDC_Out_LOT
RDC_Out_Z: IC5.13(VOC) ; port RDC_Out_Z
RDC_RESET: IC3.33(~{RESET}) ; port RDC_RESET
RDC_SAMPLE: IC3.10(~{SAMPLE}) ; port RDC_SAMPLE
RDC_VEXC: C23.2 IC4.8(V+) JP7.2 Q1.3(C) Q3.3(C) R16.2 R23.1 R31.2 R32.1
RES0: IC3.48(RES0) JP10.1 R14.2
RES1: IC3.1(RES1) JP11.1 R15.2
SIN_HO: IC3.41(SIN) ; port SIN_HO
SIN_LO: IC3.42(SINLO) ; port SIN_LO
SPI_CS: IC3.4(~{WR}/~{FSYNC}) ; port SPI_CS
SPI_SCK: IC3.13(DB13/SCLK) ; port SDI_CLK
SPI_SDI: IC3.12(DB14/SDI) ; port SPI_SDI
SPI_SDO: IC3.11(DB15/SDO) ; port SPI_SDO
Z_ISO: IC5.4(VIC) R24.2
NetC14_1: C14.1 C15.1 IC3.46(REFBYP)
NetC20_1: C20.1 IC4.2(-IN_A) R17.1 R22.2
NetC21_2: C21.2 IC3.7(CLKIN) X1.1
NetC22_2: C22.2 IC3.8(XTALOUT) X1.3
NetC27_2: C27.2 IC4.6(-IN_B) R36.2 R37.2
NetD5_1: D5.1(A) R18.1
NetD5_2: D5.2(K) D8.1(A) IC4.1(OUT_A)
NetD6_1: D6.1(A) R19.1
NetD7_1: D7.1(A) R20.1
NetD8_2: D8.2(K) R29.2
NetD9_1: D9.1(A) R33.1
NetD9_2: D9.2(K) D10.1(A) IC4.7(OUT_B)
NetD10_2: D10.2(K) R39.2
NetIC3_29: IC3.29(A) R28.1
NetIC3_30: IC3.30(B) R25.1
NetIC3_31: IC3.31(NM) R24.1
NetIC4_3: IC4.3(+IN_A) R23.2 R26.2
NetIC4_5: IC4.5(+IN_B) R32.2 R34.2
NetQ1_1: Q1.1(B) R16.1 R18.2
NetQ1_2: Q1.2(E) R21.2
NetQ2_1: Q2.1(B) R29.1 R30.1
NetQ2_2: Q2.2(E) R27.1
NetQ3_1: Q3.1(B) R31.1 R33.2
NetQ3_2: Q3.2(E) R35.2
NetQ4_1: Q4.1(B) R39.1 R40.1
NetQ4_2: Q4.2(E) R38.1

Not connected (* = marked no-connect by the designer): IC3 14(DB12)* 15(DB11)* 16(DB10)* 17(DB9)* 20(DB8)* 21(DB7)* 22(DB6)* 23(DB5)* 24(DB4)* 25(DB3)* 26(DB2)* 27(DB1)* 28(DB0)* 47(REFOUT)*

### Channels
U_Conn&PWR1/U_Resolver: designators end in A; ports COS_HO=COS_HO_U_Conn&PWR1 COS_LO=COS_LO_U_Conn&PWR1 EXC_HO=EXC_HO_U_Conn&PWR1 EXC_LO=EXC_LO_U_Conn&PWR1 RDC_Out_A=RDC_A_U_Conn&PWR1 RDC_Out_B=RDC_B_U_Conn&PWR1 RDC_Out_DIR=RDC_DIR1 RDC_Out_DOS=RDC_DOS1 RDC_Out_LOT=RDC_LOT1 RDC_Out_Z=RDC_Z_U_Conn&PWR1 RDC_RESET=RDC_RESET_U_Conn&PWR1 RDC_SAMPLE=RDC_SAMPLE_U_Conn&PWR1 SDI_CLK=RDC_SPI_CLK_U_Conn&PWR1 SIN_HO=SIN_HO_U_Conn&PWR1 SIN_LO=SIN_LO_U_Conn&PWR1 SPI_CS=RDC_SPI_CS_U_Conn&PWR1 SPI_SDI=RDC_SPI_SDI_U_Conn&PWR1 SPI_SDO=RDC_SPI_SDO_U_Conn&PWR1
U_Conn&PWR2/U_Resolver: designators end in B; ports COS_HO=COS_HO_U_Conn&PWR2 COS_LO=COS_LO_U_Conn&PWR2 EXC_HO=EXC_HO_U_Conn&PWR2 EXC_LO=EXC_LO_U_Conn&PWR2 RDC_Out_A=RDC_A_U_Conn&PWR2 RDC_Out_B=RDC_B_U_Conn&PWR2 RDC_Out_DIR=RDC_DIR2 RDC_Out_DOS=RDC_DOS2 RDC_Out_LOT=RDC_LOT2 RDC_Out_Z=RDC_Z_U_Conn&PWR2 RDC_RESET=RDC_RESET_U_Conn&PWR2 RDC_SAMPLE=RDC_SAMPLE_U_Conn&PWR2 SDI_CLK=RDC_SPI_CLK_U_Conn&PWR2 SIN_HO=SIN_HO_U_Conn&PWR2 SIN_LO=SIN_LO_U_Conn&PWR2 SPI_CS=RDC_SPI_CS_U_Conn&PWR2 SPI_SDI=RDC_SPI_SDI_U_Conn&PWR2 SPI_SDO=RDC_SPI_SDO_U_Conn&PWR2

### Notes on the sheet
- Resolver with amplifier
- Eric Shang

### Library data of the parts
C10-C29 = C: as C30 on sheet Conn&PWR; 联系售后，技术支持: https://shop463601444.taobao.com; 唯一出售店铺网址: https://shop463601444.taobao.com
D5 D8-D10 = 1N4148: 开关二极管; BOM名称: 高速开关二极管; 淘宝ID: 封装库来自淘宝 ID：黄晶宝石; 欢迎光临: https://shop463601444.taobao.com
D6 D7 = LED: 发光二极管; 技术支持，联系售后: https://shop463601444.taobao.com
IC3 = AD2S1210WDSTZ: Integrated Circuit; Manufacturer_Name: Analog Devices; Datasheet Link: https://www.analog.com/AD2S1210/datasheet; Height: 1.6mm; Manufacturer_Part_Number: AD2S1210WDSTZ; Mouser Part Number: 584-AD2S1210WDSTZ; Mouser Price/Stock: https://www.mouser.co.uk/ProductDetail/Analog-Devices/AD2S1210WDSTZ?qs=ZSGLvWohUNk0AkxKY2QFgw%3D%3D; Arrow Part Number: AD2S1210WDSTZ; Arrow Price/Stock: https://www.arrow.com/en/products/ad2s1210wdstz/analog-devices?region=asia
IC4 = AD8662ARZ: Integrated Circuit; Manufacturer_Name: Analog Devices; Datasheet Link: http://www.analog.com/static/imported-files/data_sheets/AD8661_8662.pdf; Height: 1.75mm; Manufacturer_Part_Number: AD8662ARZ; Mouser Part Number: 584-AD8662ARZ; Mouser Price/Stock: https://www.mouser.co.uk/ProductDetail/Analog-Devices/AD8662ARZ?qs=%2FtpEQrCGXCxD9FnBk1Cc6w%3D%3D; Arrow Part Number: AD8662ARZ; Arrow Price/Stock: https://www.arrow.com/en/products/ad8662arz/analog-devices?region=nac
IC5 = ADUM160N0BRZ-RL7: as IC6 on sheet Conn&PWR; Datasheet Link: https://www.analog.com/media/en/technical-documentation/data-sheets/adum160n-161n-162n-163n.pdf; Height: 1.75mm; Manufacturer_Part_Number: ADUM160N0BRZ-RL7; Mouser Part Number: 584-ADUM160N0BRZ-RL7; Mouser Price/Stock: https://www.mouser.co.uk/ProductDetail/Analog-Devices/ADUM160N0BRZ-RL7?qs=cslStgdnz9OW1mXsMBZKfA%3D%3D; Arrow Part Number: ADUM160N0BRZ-RL7; Arrow Price/Stock: https://www.arrow.com/en/products/adum160n0brz-rl7/analog-devices
JP7 = Header 3: 3P接插件; 版权归属: 封装库来自淘宝 ID：黄晶宝石; BOM名称: 3P接插件; 学习资源: https://shop463601444.taobao.com
JP8-JP11 = Header 2: 2P接插件; 版权归属: 封装库来自淘宝 ID：黄晶宝石; BOM名称: 2P接插件; 联系售后: https://shop463601444.taobao.com
Q1-Q4 = 8050-SMD: 高频放大-NPN型; 版权归属: 封装库来自淘宝 ID：黄晶宝石; 属性: 40V 1.5A 1W 100MHZ; BOM名称: 高频放大-NPN型; 联系售后: https://shop463601444.taobao.com
R12-R41 = R: as R45 on sheet Port; BOM名称: 贴片电阻; 联系售后: https://shop463601444.taobao.com
V1 = AMS1117: 三端稳压芯片; BOM名称: 稳压芯片; 淘宝ID: 封装库来自淘宝 ID：黄晶宝石; 欢迎光临淘宝店铺: https://shop463601444.taobao.com
X1 = XTAL-4P: 4脚无源晶振; 版权归属: 封装库来自淘宝卖家 ID：黄晶宝石; BOM名称: 4脚无源晶振; 学习资源: https://shop463601444.taobao.com

## Nets that join several sheets
3V3_RDC_ISO: U_Conn&PWR1/U_Resolver (12 pins), U_Conn&PWR2/U_Resolver (12 pins)
3V3DVDD: Port (6 pins), U_Conn&PWR1 (11 pins), U_Conn&PWR1/U_DiffEncoder (C6A.2 IC2A.16), U_Conn&PWR1/U_Resolver (C29A.1 IC5A.16), U_Conn&PWR2 (11 pins), U_Conn&PWR2/U_DiffEncoder (C6B.2 IC2B.16), U_Conn&PWR2/U_Resolver (C29B.1 IC5B.16)
5V_RDC_ISO: Port (D15.1 M3.4 TP6.1), U_Conn&PWR1 (C35A.2 IC8A.16), U_Conn&PWR1/U_Resolver (10 pins), U_Conn&PWR2 (C35B.2 IC8B.16), U_Conn&PWR2/U_Resolver (10 pins)
5VDVDD: Port (7 pins), U_Conn&PWR1 (IC10A.6), U_Conn&PWR2 (IC10B.6)
12V: Port (5 pins), U_Conn&PWR1/U_Resolver (JP7A.1), U_Conn&PWR2/U_Resolver (JP7B.1)
DGND: Port (16 pins), U_Conn&PWR1 (9 pins), U_Conn&PWR1/U_DiffEncoder (C6A.1 IC2A.9), U_Conn&PWR1/U_Resolver (7 pins), U_Conn&PWR2 (9 pins), U_Conn&PWR2/U_DiffEncoder (C6B.1 IC2B.9), U_Conn&PWR2/U_Resolver (7 pins)
ENC_DVDD_ISO_3V3: U_Conn&PWR1/U_Resolver (C10A.2 C11A.2 C12A.2 C13A.2), U_Conn&PWR2/U_Resolver (C10B.2 C11B.2 C12B.2 C13B.2)
ENC_DVDD_ISO_5V: Port (D13.1 M2.4 TP4.1), U_Conn&PWR1 (5 pins), U_Conn&PWR1/U_DiffEncoder (17 pins), U_Conn&PWR2 (5 pins), U_Conn&PWR2/U_DiffEncoder (17 pins)
ENC_GND: Port (M2.3 R49.1 TP5.1), U_Conn&PWR1 (5 pins), U_Conn&PWR1/U_DiffEncoder (14 pins), U_Conn&PWR2 (5 pins), U_Conn&PWR2/U_DiffEncoder (14 pins)
GND: U_Conn&PWR1/U_Resolver (C21A.1 C22A.1 X1A.2 X1A.4), U_Conn&PWR2/U_Resolver (C21B.1 C22B.1 X1B.2 X1B.4)
HALL_DVDD_ISO_5V: Port (D12.1 M1.4 TP2.1), U_Conn&PWR1 (C30A.1 IC6A.1 JP14A.1 JP15A.1), U_Conn&PWR2 (C30B.1 IC6B.1 JP14B.1 JP15B.1)
HALL_GND: Port (M1.3 R46.1 TP3.1), U_Conn&PWR1 (6 pins), U_Conn&PWR2 (6 pins)
RDC_AGND_ISO: U_Conn&PWR1/U_Resolver (16 pins), U_Conn&PWR2/U_Resolver (16 pins)
RDC_DGND_ISO: Port (M3.3 R51.1 TP7.1), U_Conn&PWR1 (C35A.1 IC8A.9), U_Conn&PWR1/U_Resolver (14 pins), U_Conn&PWR2 (C35B.1 IC8B.9), U_Conn&PWR2/U_Resolver (14 pins)
A1: Port (J1.E1), U_Conn&PWR1 (IC10A.8 RJ1A.1), U_Conn&PWR1/U_DiffEncoder (C1A.1 DR1A.1 IC1A.32)
A2: Port (J1.E5), U_Conn&PWR2 (IC10B.8 RJ1B.1), U_Conn&PWR2/U_DiffEncoder (C1B.1 DR1B.1 IC1B.32)
AUX_1_Diff1: Port (J1.S25), U_Conn&PWR1/U_DiffEncoder (IC2A.12)
AUX_1_Diff2: Port (J1.E23), U_Conn&PWR2/U_DiffEncoder (IC2B.12)
AUX_21: Port (J1.S26), U_Conn&PWR1/U_DiffEncoder (IC2A.11)
AUX_22: Port (J1.E24), U_Conn&PWR2/U_DiffEncoder (IC2B.11)
AUX_31: Port (J1.S27), U_Conn&PWR1/U_DiffEncoder (IC2A.10)
AUX_32: Port (J1.E25), U_Conn&PWR2/U_DiffEncoder (IC2B.10)
AUX_~{A}_U_Conn&PWR1: U_Conn&PWR1 (JP12A.4), U_Conn&PWR1/U_DiffEncoder (DR4A.1 IC1A.15 R8A.2)
AUX_~{A}_U_Conn&PWR2: U_Conn&PWR2 (JP12B.4), U_Conn&PWR2/U_DiffEncoder (DR4B.1 IC1B.15 R8B.2)
AUX_A_U_Conn&PWR1: U_Conn&PWR1 (JP12A.3), U_Conn&PWR1/U_DiffEncoder (C4A.1 DR4A.2 IC1A.16)
AUX_A_U_Conn&PWR2: U_Conn&PWR2 (JP12B.3), U_Conn&PWR2/U_DiffEncoder (C4B.1 DR4B.2 IC1B.16)
AUX_InB_U_Conn&PWR1: U_Conn&PWR1 (JP12A.2), U_Conn&PWR1/U_DiffEncoder (IC1A.13)
AUX_InB_U_Conn&PWR2: U_Conn&PWR2 (JP12B.2), U_Conn&PWR2/U_DiffEncoder (IC1B.13)
AUX_InC_U_Conn&PWR1: U_Conn&PWR1 (JP12A.1), U_Conn&PWR1/U_DiffEncoder (IC1A.29)
AUX_InC_U_Conn&PWR2: U_Conn&PWR2 (JP12B.1), U_Conn&PWR2/U_DiffEncoder (IC1B.29)
B1: Port (J1.E2), U_Conn&PWR1 (IC9A.8 RJ1A.3), U_Conn&PWR1/U_DiffEncoder (DR2A.1 IC1A.9 R4A.2)
B2: Port (J1.E6), U_Conn&PWR2 (IC9B.8 RJ1B.3), U_Conn&PWR2/U_DiffEncoder (DR2B.1 IC1B.9 R4B.2)
COS_HO_U_Conn&PWR1: U_Conn&PWR1 (RJ2A.3), U_Conn&PWR1/U_Resolver (IC3A.45)
COS_HO_U_Conn&PWR2: U_Conn&PWR2 (RJ2B.3), U_Conn&PWR2/U_Resolver (IC3B.45)
COS_LO_U_Conn&PWR1: U_Conn&PWR1 (RJ2A.4), U_Conn&PWR1/U_Resolver (IC3A.44)
COS_LO_U_Conn&PWR2: U_Conn&PWR2 (RJ2B.4), U_Conn&PWR2/U_Resolver (IC3B.44)
DiffENC_SPI_CLK_U_Conn&PWR1: U_Conn&PWR1 (IC7A.15 JP13A.2), U_Conn&PWR1/U_DiffEncoder (R2A.2)
DiffENC_SPI_CLK_U_Conn&PWR2: U_Conn&PWR2 (IC7B.15 JP13B.2), U_Conn&PWR2/U_DiffEncoder (R2B.2)
DiffENC_SPI_CS_U_Conn&PWR1: U_Conn&PWR1 (IC7A.12), U_Conn&PWR1/U_DiffEncoder (R2A.3)
DiffENC_SPI_CS_U_Conn&PWR2: U_Conn&PWR2 (IC7B.12), U_Conn&PWR2/U_DiffEncoder (R2B.3)
DiffENC_SPI_SDI_U_Conn&PWR1: U_Conn&PWR1 (IC7A.14 JP13A.3), U_Conn&PWR1/U_DiffEncoder (R2A.1)
DiffENC_SPI_SDI_U_Conn&PWR2: U_Conn&PWR2 (IC7B.14 JP13B.3), U_Conn&PWR2/U_DiffEncoder (R2B.1)
DiffENC_SPI_SDO_U_Conn&PWR1: U_Conn&PWR1 (IC7A.10 JP13A.4), U_Conn&PWR1/U_DiffEncoder (R2A.4)
DiffENC_SPI_SDO_U_Conn&PWR2: U_Conn&PWR2 (IC7B.10 JP13B.4), U_Conn&PWR2/U_DiffEncoder (R2B.4)
ENC_~{A}_U_Conn&PWR1: U_Conn&PWR1 (RJ1A.2), U_Conn&PWR1/U_DiffEncoder (DR1A.2 IC1A.31 R6A.2)
ENC_~{A}_U_Conn&PWR2: U_Conn&PWR2 (RJ1B.2), U_Conn&PWR2/U_DiffEncoder (DR1B.2 IC1B.31 R6B.2)
ENC_~{B}_U_Conn&PWR1: U_Conn&PWR1 (RJ1A.4), U_Conn&PWR1/U_DiffEncoder (C2A.1 DR2A.2 IC1A.10)
ENC_~{B}_U_Conn&PWR2: U_Conn&PWR2 (RJ1B.4), U_Conn&PWR2/U_DiffEncoder (C2B.1 DR2B.2 IC1B.10)
ENC_Z: Port (J1.E3), U_Conn&PWR1 (IC11A.8 RJ1A.5), U_Conn&PWR1/U_DiffEncoder (DR3A.2 IC1A.25 R9A.2)
ENC_Z: Port (J1.E7), U_Conn&PWR2 (IC11B.8 RJ1B.5), U_Conn&PWR2/U_DiffEncoder (DR3B.2 IC1B.25 R9B.2)
ENC_~{Z}_U_Conn&PWR1: U_Conn&PWR1 (RJ1A.6), U_Conn&PWR1/U_DiffEncoder (C3A.1 DR3A.1 IC1A.26)
ENC_~{Z}_U_Conn&PWR2: U_Conn&PWR2 (RJ1B.6), U_Conn&PWR2/U_DiffEncoder (C3B.1 DR3B.1 IC1B.26)
EXC_HO_U_Conn&PWR1: U_Conn&PWR1 (RJ2A.1), U_Conn&PWR1/U_Resolver (C20A.2 R17A.2 R21A.1 R27A.2)
EXC_HO_U_Conn&PWR2: U_Conn&PWR2 (RJ2B.1), U_Conn&PWR2/U_Resolver (C20B.2 R17B.2 R21B.1 R27B.2)
EXC_LO_U_Conn&PWR1: U_Conn&PWR1 (RJ2A.2), U_Conn&PWR1/U_Resolver (C27A.1 R35A.1 R37A.1 R38A.2)
EXC_LO_U_Conn&PWR2: U_Conn&PWR2 (RJ2B.2), U_Conn&PWR2/U_Resolver (C27B.1 R35B.1 R37B.1 R38B.2)
MB_ENC_SPI_CLK1: Port (J1.S18), U_Conn&PWR1 (IC7A.2)
MB_ENC_SPI_CLK2: Port (J1.E16), U_Conn&PWR2 (IC7B.2)
MB_ENC_SPI_CS1: Port (J1.S17), U_Conn&PWR1 (IC7A.5)
MB_ENC_SPI_CS2: Port (J1.E15), U_Conn&PWR2 (IC7B.5)
MB_ENC_SPI_SDI1: Port (J1.S19), U_Conn&PWR1 (IC7A.3)
MB_ENC_SPI_SDI2: Port (J1.E17), U_Conn&PWR2 (IC7B.3)
MB_ENC_SPI_SDO1: Port (J1.S21), U_Conn&PWR1 (IC7A.7)
MB_ENC_SPI_SDO2: Port (J1.E19), U_Conn&PWR2 (IC7B.7)
MB_MTENC_SPI_CS1: Port (J1.S20), U_Conn&PWR1 (IC7A.4)
MB_MTENC_SPI_CS2: Port (J1.E18), U_Conn&PWR2 (IC7B.4)
MB_RDC_RESET1: Port (J1.S16), U_Conn&PWR1 (IC8A.6)
MB_RDC_RESET2: Port (J1.E14), U_Conn&PWR2 (IC8B.6)
MB_RDC_SAMPLE1: Port (J1.S15), U_Conn&PWR1 (IC8A.5)
MB_RDC_SAMPLE2: Port (J1.E13), U_Conn&PWR2 (IC8B.5)
MB_RDC_SPI_CLK1: Port (J1.S12), U_Conn&PWR1 (IC8A.2)
MB_RDC_SPI_CLK2: Port (J1.E10), U_Conn&PWR2 (IC8B.2)
MB_RDC_SPI_CS1: Port (J1.S14), U_Conn&PWR1 (IC8A.4)
MB_RDC_SPI_CS2: Port (J1.E12), U_Conn&PWR2 (IC8B.4)
MB_RDC_SPI_SDI1: Port (J1.S13), U_Conn&PWR1 (IC8A.3)
MB_RDC_SPI_SDI2: Port (J1.E11), U_Conn&PWR2 (IC8B.3)
MB_RDC_SPI_SDO1: Port (J1.S11), U_Conn&PWR1 (IC8A.7)
MB_RDC_SPI_SDO2: Port (J1.E9), U_Conn&PWR2 (IC8B.7)
MUX_A0: Port (J1.E22), U_Conn&PWR2 (IC9B.1 IC10B.1 IC11B.1)
MUX_A0: Port (J1.S24), U_Conn&PWR1 (IC9A.1 IC10A.1 IC11A.1)
MUX_A1: Port (J1.E21), U_Conn&PWR2 (IC9B.10 IC10B.10 IC11B.10)
MUX_A1: Port (J1.S23), U_Conn&PWR1 (IC9A.10 IC10A.10 IC11A.10)
RDC_A_U_Conn&PWR1: U_Conn&PWR1 (IC10A.9), U_Conn&PWR1/U_Resolver (IC5A.15)
RDC_A_U_Conn&PWR2: U_Conn&PWR2 (IC10B.9), U_Conn&PWR2/U_Resolver (IC5B.15)
RDC_B_U_Conn&PWR1: U_Conn&PWR1 (IC9A.9), U_Conn&PWR1/U_Resolver (IC5A.14)
RDC_B_U_Conn&PWR2: U_Conn&PWR2 (IC9B.9), U_Conn&PWR2/U_Resolver (IC5B.14)
RDC_DIR1: Port (J1.S8), U_Conn&PWR1/U_Resolver (IC5A.10)
RDC_DIR2: Port (J1.S5), U_Conn&PWR2/U_Resolver (IC5B.10)
RDC_DOS1: Port (J1.S6), U_Conn&PWR1/U_Resolver (IC5A.12)
RDC_DOS2: Port (J1.S3), U_Conn&PWR2/U_Resolver (IC5B.12)
RDC_LOT1: Port (J1.S7), U_Conn&PWR1/U_Resolver (IC5A.11)
RDC_LOT2: Port (J1.S4), U_Conn&PWR2/U_Resolver (IC5B.11)
RDC_RESET_U_Conn&PWR1: U_Conn&PWR1 (IC8A.11), U_Conn&PWR1/U_Resolver (IC3A.33)
RDC_RESET_U_Conn&PWR2: U_Conn&PWR2 (IC8B.11), U_Conn&PWR2/U_Resolver (IC3B.33)
RDC_SAMPLE_U_Conn&PWR1: U_Conn&PWR1 (IC8A.12), U_Conn&PWR1/U_Resolver (IC3A.10)
RDC_SAMPLE_U_Conn&PWR2: U_Conn&PWR2 (IC8B.12), U_Conn&PWR2/U_Resolver (IC3B.10)
RDC_SPI_CLK_U_Conn&PWR1: U_Conn&PWR1 (IC8A.15), U_Conn&PWR1/U_Resolver (IC3A.13)
RDC_SPI_CLK_U_Conn&PWR2: U_Conn&PWR2 (IC8B.15), U_Conn&PWR2/U_Resolver (IC3B.13)
RDC_SPI_CS_U_Conn&PWR1: U_Conn&PWR1 (IC8A.13), U_Conn&PWR1/U_Resolver (IC3A.4)
RDC_SPI_CS_U_Conn&PWR2: U_Conn&PWR2 (IC8B.13), U_Conn&PWR2/U_Resolver (IC3B.4)
RDC_SPI_SDI_U_Conn&PWR1: U_Conn&PWR1 (IC8A.14), U_Conn&PWR1/U_Resolver (IC3A.12)
RDC_SPI_SDI_U_Conn&PWR2: U_Conn&PWR2 (IC8B.14), U_Conn&PWR2/U_Resolver (IC3B.12)
RDC_SPI_SDO_U_Conn&PWR1: U_Conn&PWR1 (IC8A.10), U_Conn&PWR1/U_Resolver (IC3A.11)
RDC_SPI_SDO_U_Conn&PWR2: U_Conn&PWR2 (IC8B.10), U_Conn&PWR2/U_Resolver (IC3B.11)
RDC_Z_U_Conn&PWR1: U_Conn&PWR1 (IC11A.9), U_Conn&PWR1/U_Resolver (IC5A.13)
RDC_Z_U_Conn&PWR2: U_Conn&PWR2 (IC11B.9), U_Conn&PWR2/U_Resolver (IC5B.13)
SIN_HO_U_Conn&PWR1: U_Conn&PWR1 (RJ2A.6), U_Conn&PWR1/U_Resolver (IC3A.41)
SIN_HO_U_Conn&PWR2: U_Conn&PWR2 (RJ2B.6), U_Conn&PWR2/U_Resolver (IC3B.41)
SIN_LO_U_Conn&PWR1: U_Conn&PWR1 (RJ2A.5), U_Conn&PWR1/U_Resolver (IC3A.42)
SIN_LO_U_Conn&PWR2: U_Conn&PWR2 (RJ2B.5), U_Conn&PWR2/U_Resolver (IC3B.42)
STD_A_U_Conn&PWR1: U_Conn&PWR1 (IC10A.2), U_Conn&PWR1/U_DiffEncoder (IC2A.15)
STD_A_U_Conn&PWR2: U_Conn&PWR2 (IC10B.2), U_Conn&PWR2/U_DiffEncoder (IC2B.15)
STD_B_U_Conn&PWR1: U_Conn&PWR1 (IC9A.2), U_Conn&PWR1/U_DiffEncoder (IC2A.14)
STD_B_U_Conn&PWR2: U_Conn&PWR2 (IC9B.2), U_Conn&PWR2/U_DiffEncoder (IC2B.14)
STD_Z_U_Conn&PWR1: U_Conn&PWR1 (IC11A.2), U_Conn&PWR1/U_DiffEncoder (IC2A.13)
STD_Z_U_Conn&PWR2: U_Conn&PWR2 (IC11B.2), U_Conn&PWR2/U_DiffEncoder (IC2B.13)